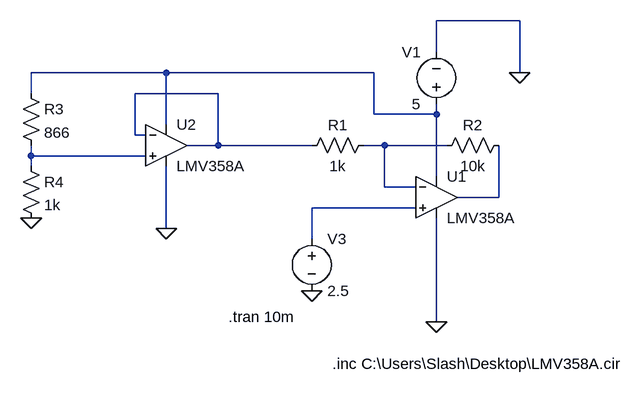
[diagram p0: schematic current_sensing.asc]
current_sensing.asc, the LTspice schematic file:
Version 4
SHEET 1 880 680
WIRE 384 -160 256 -160
WIRE 256 -112 256 -160
WIRE -160 -80 -368 -80
WIRE 160 -80 -160 -80
WIRE 384 -80 384 -160
WIRE -368 -48 -368 -80
WIRE -80 -48 -208 -48
WIRE 160 -16 160 -80
WIRE 256 -16 256 -32
WIRE 256 -16 160 -16
WIRE -160 0 -160 -80
WIRE -208 16 -208 -48
WIRE -192 16 -208 16
WIRE -80 32 -80 -48
WIRE -80 32 -128 32
WIRE 64 32 -80 32
WIRE 176 32 144 32
WIRE 272 32 176 32
WIRE -368 48 -368 32
WIRE -192 48 -368 48
WIRE -368 64 -368 48
WIRE 256 80 256 -16
WIRE 176 96 176 32
WIRE 224 96 176 96
WIRE 352 112 352 32
WIRE 352 112 288 112
WIRE 224 128 64 128
WIRE -160 160 -160 64
WIRE 64 176 64 128
WIRE 256 304 256 144
FLAG 384 -80 0
FLAG 64 256 0
FLAG 256 304 0
FLAG -160 160 0
FLAG -368 144 0
SYMBOL res 160 16 R90
WINDOW 0 0 56 VBottom 2
WINDOW 3 32 56 VTop 2
SYMATTR InstName R1
SYMATTR Value 1k
SYMBOL res 368 16 R90
WINDOW 0 0 56 VBottom 2
WINDOW 3 32 56 VTop 2
SYMATTR InstName R2
SYMATTR Value 10k
SYMATTR SpiceLine tol=1
SYMBOL voltage 256 -16 R180
WINDOW 0 24 96 Left 2
WINDOW 3 24 16 Left 2
WINDOW 123 0 0 Left 0
WINDOW 39 0 0 Left 0
SYMATTR InstName V1
SYMATTR Value 5
SYMBOL voltage 64 160 R0
WINDOW 123 0 0 Left 0
WINDOW 39 0 0 Left 0
SYMATTR InstName V3
SYMATTR Value 2.5
SYMBOL res -384 -64 R0
SYMATTR InstName R3
SYMATTR Value 866
SYMBOL res -384 48 R0
SYMATTR InstName R4
SYMATTR Value 1k
SYMBOL Opamps\\opamp2 256 48 R0
SYMATTR InstName U1
SYMATTR Value LMV358A
SYMBOL Opamps\\opamp2 -160 -32 R0
SYMATTR InstName U2
SYMATTR Value LMV358A
TEXT -64 296 Left 2 !.tran 10m
TEXT 96 368 Left 2 !.inc C:\\Users\\Slash\\Desktop\\LMV358A.cir

The netlist it stands for:
* current_sensing.asc
R1 N003 N002 1k
R2 N005 N003 10k tol=1
V1 N001 0 5
V3 N006 0 2.5
R3 N001 N004 866
R4 N004 0 1k
XU1 N006 N003 N001 0 N005 LMV358A  ; pins In+ In- V+ V- OUT
XU2 N004 N002 N001 0 N002 LMV358A  ; pins In+ In- V+ V- OUT
.tran 10m
.inc C:\Users\Slash\Desktop\LMV358A.cir
.backanno
.end